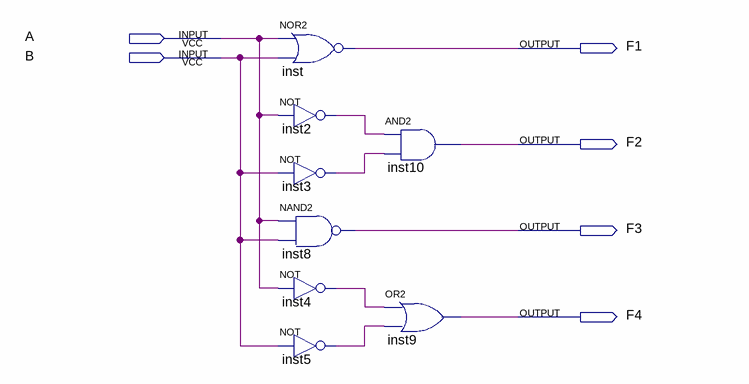
[diagram p0: schematic sheet]
// Quartus schematic 913010 (1).bdf as structural Verilog: 8 symbols, 6 pins
module \913010_(1)  (
  input  A,
  input  B,
  output F1,
  output F2,
  output F3,
  output F4
);

  wire inst2_out, inst3_out, inst4_out, inst5_out;

  nor inst (F1, A, B);
  not inst2 (inst2_out, A);
  not inst3 (inst3_out, B);
  nand inst8 (F3, A, B);
  not inst4 (inst4_out, A);
  not inst5 (inst5_out, B);
  and inst10 (F2, inst2_out, inst3_out);
  or inst9 (F4, inst4_out, inst5_out);
endmodule
